# Altium schematic sheet Sheet1.SchDoc
size A; SheetNumber: 1; SheetTotal: 1
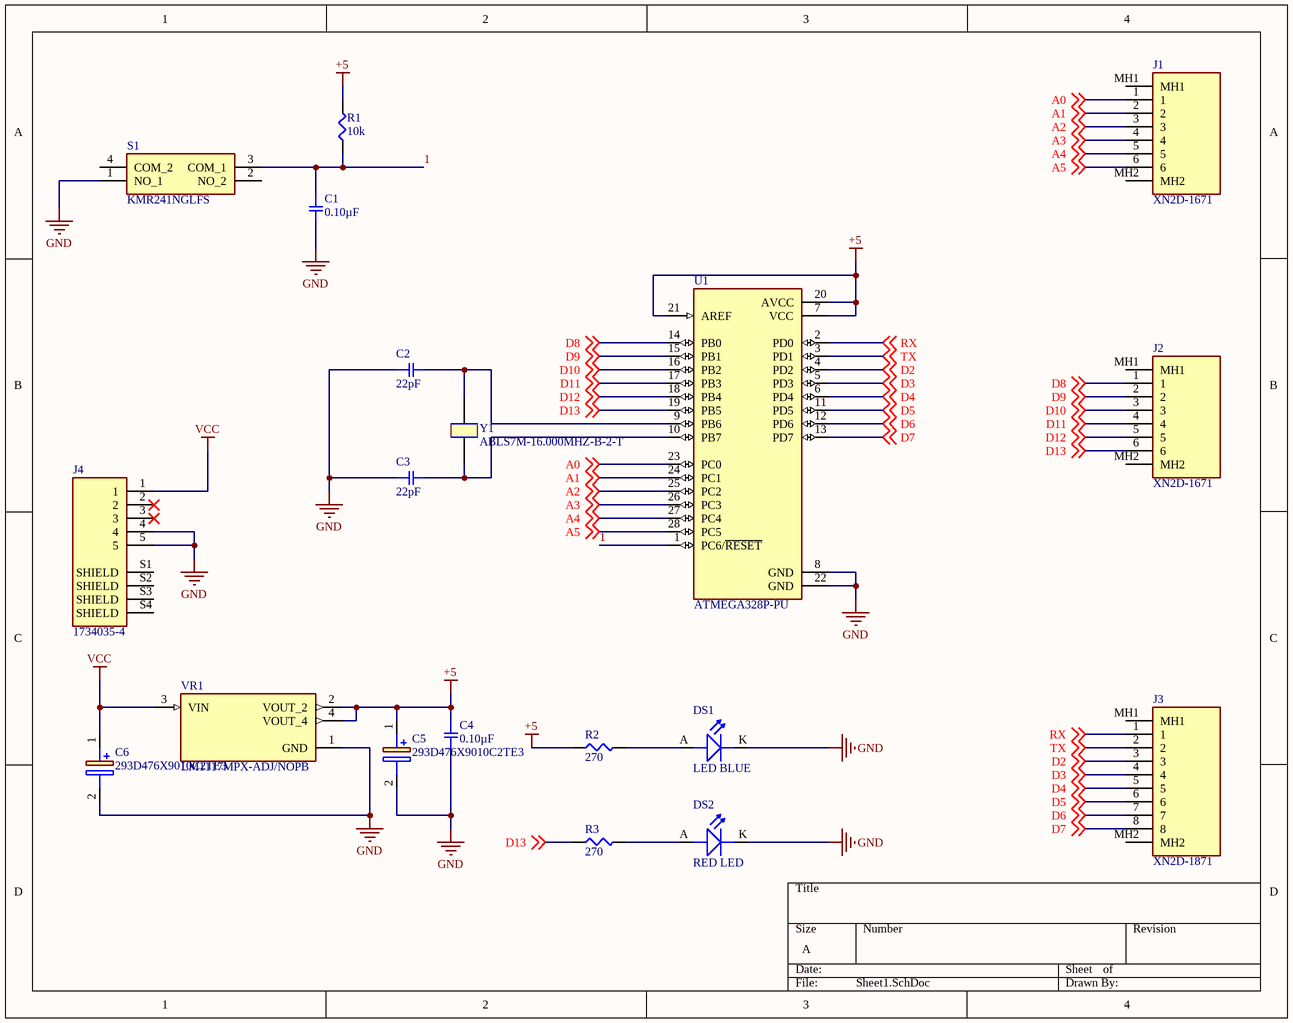
[diagram p0: Sheet1.SchDoc]

## Parts
C1  0.10µF  [SMD-0402C]
C2  22pF  [SMD-0402C]
C3  22pF  [SMD-0402C]
C4  0.10µF  [SMD-0402C]
C5  293D476X9010C2TE3  [CAPPM6032X280N]
C6  293D476X9010C2TE3  [CAPPM6032X280N]
DS1  LED BLUE  [LED_0805]
DS2  RED LED  [LED_0805]
J1  XN2D-1671  [XN2D1671]
J2  XN2D-1671  [XN2D1671]
J3  XN2D-1871  [XN2D1871]
J4  1734035-4  [J_SMD_1734035-4-5_0.8_9.9_8.85_3.9]
R1  10k  [SMD-0402-RES]
R2  270  [SMD-0402-RES]
R3  270  [SMD-0402-RES]
S1  KMR241NGLFS  [KMR241NGLFS]
U1  ATMEGA328P-PU  [DIP794W46P254L2967H457Q28B]
VR1  LM1117MPX-ADJ/NOPB  [VREG_LM1117MPX-ADJ/NOPB]
Y1  ABLS7M-16.000MHZ-B-2-T  [XTAL_314_240X47_SMD]

## Nets
+5: C4.1 C5.1(+) R1.2 R2.1 U1.7(VCC) U1.20(AVCC) U1.21(AREF) VR1.2(VOUT_2) VR1.4(VOUT_4)
GND: C1.2 C2.1 C3.1 C4.2 C5.2(-) C6.2(-) DS1.K(CATHODE) DS2.K(CATHODE) J4.4 J4.5 S1.1(NO_1) U1.8(GND) U1.22(GND) VR1.1(GND)
VCC: C6.1(+) J4.1 VR1.3(VIN)
1: C1.1 R1.1 S1.3(COM_1) U1.1(PC6/~{RESET})
A0: J1.1 U1.23(PC0) ; off-sheet A0
A1: J1.2 U1.24(PC1) ; off-sheet A1
A2: J1.3 U1.25(PC2) ; off-sheet A2
A3: J1.4 U1.26(PC3) ; off-sheet A3
A4: J1.5 U1.27(PC4) ; off-sheet A4
A5: J1.6 U1.28(PC5) ; off-sheet A5
D2: J3.3 U1.4(PD2) ; off-sheet D2
D3: J3.4 U1.5(PD3) ; off-sheet D3
D4: J3.5 U1.6(PD4) ; off-sheet D4
D5: J3.6 U1.11(PD5) ; off-sheet D5
D6: J3.7 U1.12(PD6) ; off-sheet D6
D7: J3.8 U1.13(PD7) ; off-sheet D7
D8: J2.1 U1.14(PB0) ; off-sheet D8
D9: J2.2 U1.15(PB1) ; off-sheet D9
D10: J2.3 U1.16(PB2) ; off-sheet D10
D11: J2.4 U1.17(PB3) ; off-sheet D11
D12: J2.5 U1.18(PB4) ; off-sheet D12
D13: J2.6 R3.1 U1.19(PB5) ; off-sheet D13
RX: J3.1 U1.2(PD0) ; off-sheet RX
TX: J3.2 U1.3(PD1) ; off-sheet TX
NetC2_2: C2.2 U1.9(PB6) Y1.2
NetC3_2: C3.2 U1.10(PB7) Y1.1
NetDS1_A: DS1.A(ANODE) R2.2
NetDS2_A: DS2.A(ANODE) R3.2

Not connected (* = marked no-connect by the designer): J1 MH1 MH2; J2 MH1 MH2; J3 MH1 MH2; J4 2* 3* S1(SHIELD) S2(SHIELD) S3(SHIELD) S4(SHIELD); S1 2(NO_2) 4(COM_2)

## Library data of the parts
C1 C4 = GCM155R71C104KA55D: CAP CER 0.1UF 16V X7R 0402; Manufacturer: Murata Electronics North America; Factory Stock: 0; Unit Price (USD): 0.1; Minimum Quantity: 1; Tolerance: ±10%; Datasheets: http://www.murata.com/~/media/webrenewal/support/library/catalog/products/capacitor/mlcc/c03e.ashx; Image: //media.digikey.com/Renders/Murata%20Renders/ZRB-SERIES-0402.jpg; Digi-Key Part Number: 490-4759-1-ND; Part Number: GCM155R71C104KA55D; Quantity Available: 734194; @ qty: 0; Packaging: Cut Tape (CT); Series: GCM; Part Status: Active; Value: 0.10µF; Voltage: 16V; Temperature Coefficient: X7R; Operating Temperature: -55°C ~ 125°C; Features: -; Ratings: AEC-Q200; Applications: Automotive; Mounting Type: Surface Mount, MLCC; Package / Case: 0402 (1005 Metric); Size / Dimension: 0.039" L x 0.020" W (1.00mm x 0.50mm); Height - Seated (Max): -; Thickness (Max): 0.022" (0.55mm); Lead Spacing: -; Lead Style: -
C2 C3 = GRM1555C1E220GA01D: CAP CER 22PF 25V NP0 0402; Manufacturer: Murata Electronics North America; Factory Stock: 0; Unit Price (USD): 0.1; Minimum Quantity: 1; Tolerance: ±2%; Temperature Coefficient: C0G, NP0; Datasheets: http://www.murata.com/~/media/webrenewal/support/library/catalog/products/capacitor/mlcc/c02e.pdf; Image: //media.digikey.com/Renders/Murata%20Renders/ZRB-SERIES-0402.jpg; Digi-Key Part Number: 490-8173-1-ND; Part Number: GRM1555C1E220GA01D; Quantity Available: 165276; @ qty: 0; Packaging: Cut Tape (CT); Series: GRM; Part Status: Active; Value: 22pF; Voltage: 25V; Operating Temperature: -55°C ~ 125°C; Features: -; Ratings: -; Applications: General Purpose; Mounting Type: Surface Mount, MLCC; Package / Case: 0402 (1005 Metric); Size / Dimension: 0.039" L x 0.020" W (1.00mm x 0.50mm); Height - Seated (Max): -; Thickness (Max): 0.022" (0.55mm); Lead Spacing: -; Lead Style: -
C5 C6 = 293D476X9010C2TE3: Capacitor Polarised; Manufacturer_Name: Vishay; Datasheet Link: http://www.vishay.com/docs/40002/293d.pdf; Height: 2.8mm; Manufacturer_Part_Number: 293D476X9010C2TE3; Mouser Part Number: 74-293D476X9010C2TE3; Mouser Price/Stock: https://www.mouser.co.uk/ProductDetail/Vishay-Sprague/293D476X9010C2TE3?qs=L4BSZja3YaLjW7yb5EwZTw%3D%3D; Arrow Part Number: 293D476X9010C2TE3; Arrow Price/Stock: https://www.arrow.com/en/products/293d476x9010c2te3/vishay
DS1 = LED_BLUE-3V3-20mA-0805: Blue 470nm LED Indication - Discrete 3.3V 0805 (2012 Metric); Manufacturer: Vishay Lite-On; Manufacturer Part Number: LTST-C171TBKT; Alternate Part Number-1: NA; Case/Package: 0805; Supplier-1: SP ROAD; Supplier Part Number-1: LTST-C171TBKT
DS2 = LED_RED-2V-20mA-0805: Red 631nm LED Indication - Discrete 2V 0805 (2012 Metric); Manufacturer: Vishay Lite-On; Manufacturer Part Number: LTST-C171KRKT; Alternate Part Number-1: NA; Case/Package: 0805; Supplier-1: SP ROAD; Supplier Part Number-1: LTST-C171KRKT
J1 J2 = XN2D-1671: Connector; Manufacturer_Name: Omron Electronics; Datasheet Link: https://componentsearchengine.com/Datasheets/1/XN2D-1671.pdf; Height: 13mm; Manufacturer_Part_Number: XN2D-1671; Mouser Part Number: 653-XN2D-1671; Mouser Price/Stock: https://www.mouser.co.uk/ProductDetail/Omron-Electronics/XN2D-1671/?qs=HnaUIVfgVjDqExZIAnw1oQ%3D%3D
J3 = XN2D-1871: Connector; Manufacturer_Name: Omron Electronics; Datasheet Link: https://datasheet.datasheetarchive.com/originals/distributors/Datasheets_SAMA/5a7ce62f2dc56be3f4960af2e1972c5d.pdf; Height: 13mm; Manufacturer_Part_Number: XN2D-1871
J4 = 1734035-4: Conn Mini USB 2.0 Type B RCP 5 POS 0.8mm Solder RA SMD 5 Terminal 1 Port Automotive T/R; MF: {'manufacturer': u'TE Connectivity'}; Package: None; Price: None; Value: *; MP: 1734035-4; Availability: Unavailable
R1 = ERJ-2GEJ103X: RES SMD 10K OHM 5% 1/10W 0402; Manufacturer: Panasonic Electronic Components; Factory Stock: 0; Unit Price (USD): 0.00350; @ qty: 1500; Minimum Quantity: 1; Power (Watts): 0.1W, 1/10W; Temperature Coefficient: ±200ppm/°C; Part Number: ERJ-2GEJ103X; Datasheets: http://industrial.panasonic.com/www-cgi/jvcr13pz.cgi?E+PZ+3+AOA0001+ERJ2GEJ103X+7+WW; Image: //media.digikey.com/Photos/Panasonic%20Photos/ERJ-PA2-Series.jpg; Digi-Key Part Number: P10KJCT-ND; Quantity Available: 2560215; Packaging: Cut Tape (CT); Series: ERJ; Part Status: Active; Value: 10k; Tolerance: ±5%; Composition: Thick Film; Features: Automotive AEC-Q200; Operating Temperature: -55°C ~ 155°C; Package / Case: 0402 (1005 Metric); Supplier Device Package: 0402; Size / Dimension: 0.039" L x 0.020" W (1.00mm x 0.50mm); Height - Seated (Max): 0.016" (0.40mm); Number of Terminations: 2; Failure Rate: -
R2 R3 = ERJ-2RKF2700X: RES SMD 270 OHM 1% 1/10W 0402; Manufacturer: Panasonic Electronic Components; Factory Stock: 0; Unit Price (USD): 0.00496; @ qty: 1500; Minimum Quantity: 1; Power (Watts): 0.1W, 1/10W; Temperature Coefficient: ±100ppm/°C; Part Number: ERJ-2RKF2700X; Datasheets: http://industrial.panasonic.com/www-cgi/jvcr13pz.cgi?E+PZ+3+AOA0002+ERJ2RKF2700X+7+WW; Image: //media.digikey.com/Photos/Panasonic%20Photos/ERJ-PA2-Series.jpg; Digi-Key Part Number: P270LCT-ND; Quantity Available: 74905; Packaging: Cut Tape (CT); Series: ERJ; Part Status: Active; Value: 270; Tolerance: ±1%; Composition: Thick Film; Features: Automotive AEC-Q200; Operating Temperature: -55°C ~ 155°C; Package / Case: 0402 (1005 Metric); Supplier Device Package: 0402; Size / Dimension: 0.039" L x 0.020" W (1.00mm x 0.50mm); Height - Seated (Max): 0.016" (0.40mm); Number of Terminations: 2; Failure Rate: -
S1 = KMR241NGLFS: Switch; Manufacturer_Name: C & K COMPONENTS; Datasheet Link: https://www.ckswitches.com/media/1479/kmr2.pdf; Height: 1.9mm; Manufacturer_Part_Number: KMR241NGLFS; Mouser Part Number: 611-KMR241NGLFS; Mouser Price/Stock: https://www.mouser.co.uk/ProductDetail/CK/KMR241NGLFS?qs=sb%252But3Lm4x3MOq2auuFbeg%3D%3D; Arrow Part Number: KMR241NGLFS; Arrow Price/Stock: https://www.arrow.com/en/products/kmr241nglfs/ck
U1 = ATMEGA328P-PU: ATmega Series 20 MHz 32 KB Flash 2 KB SRAM 8-Bit Microcontroller - DIP-28; MF: {'manufacturer': u'Microchip Technology'}; Package: None; Price: None; Value: *; MP: ATMEGA328P-PU; Availability: Unavailable
VR1 = LM1117MPX-ADJ/NOPB: 800-mA 15-V linear voltage regulator 4-SOT-223 0 to 125  <a href="https://pricing.snapeda.com/parts/LM1117MPX-ADJ/NOPB/Texas%20Instruments/view-part?ref=eda">Check availability</a> <a href="https://pricing.snapeda.com/parts/LM1117MPX-ADJ/NOPB/Texas%20Instruments/view-part?ref=eda">Check availability</a>; MF: {'manufacturer': u'Texas Instruments'}; Package: None; Price: None; Value: *; MP: LM1117MPX-ADJ/NOPB; Availability: Unavailable
Y1 = XTAL_16MHz-ABLS7M-16.000MHZ-B-2-T: 16MHz ±20ppm Crystal 18pF 60 Ohms 2-SMD, Flat Lead; Manufacturer: Abracon; Alternate Part Number-1: NA; Manufacturer Part Number: ABLS7M-16.000MHZ-B-2-T; Case/Package: SMD; Supplier-1: ARROW; Supplier Part Number-1: ABLS7M-16.000MHZ-B-2-T